# EAGLE design radiationsensor_r1 (EAGLE 6.5.0)
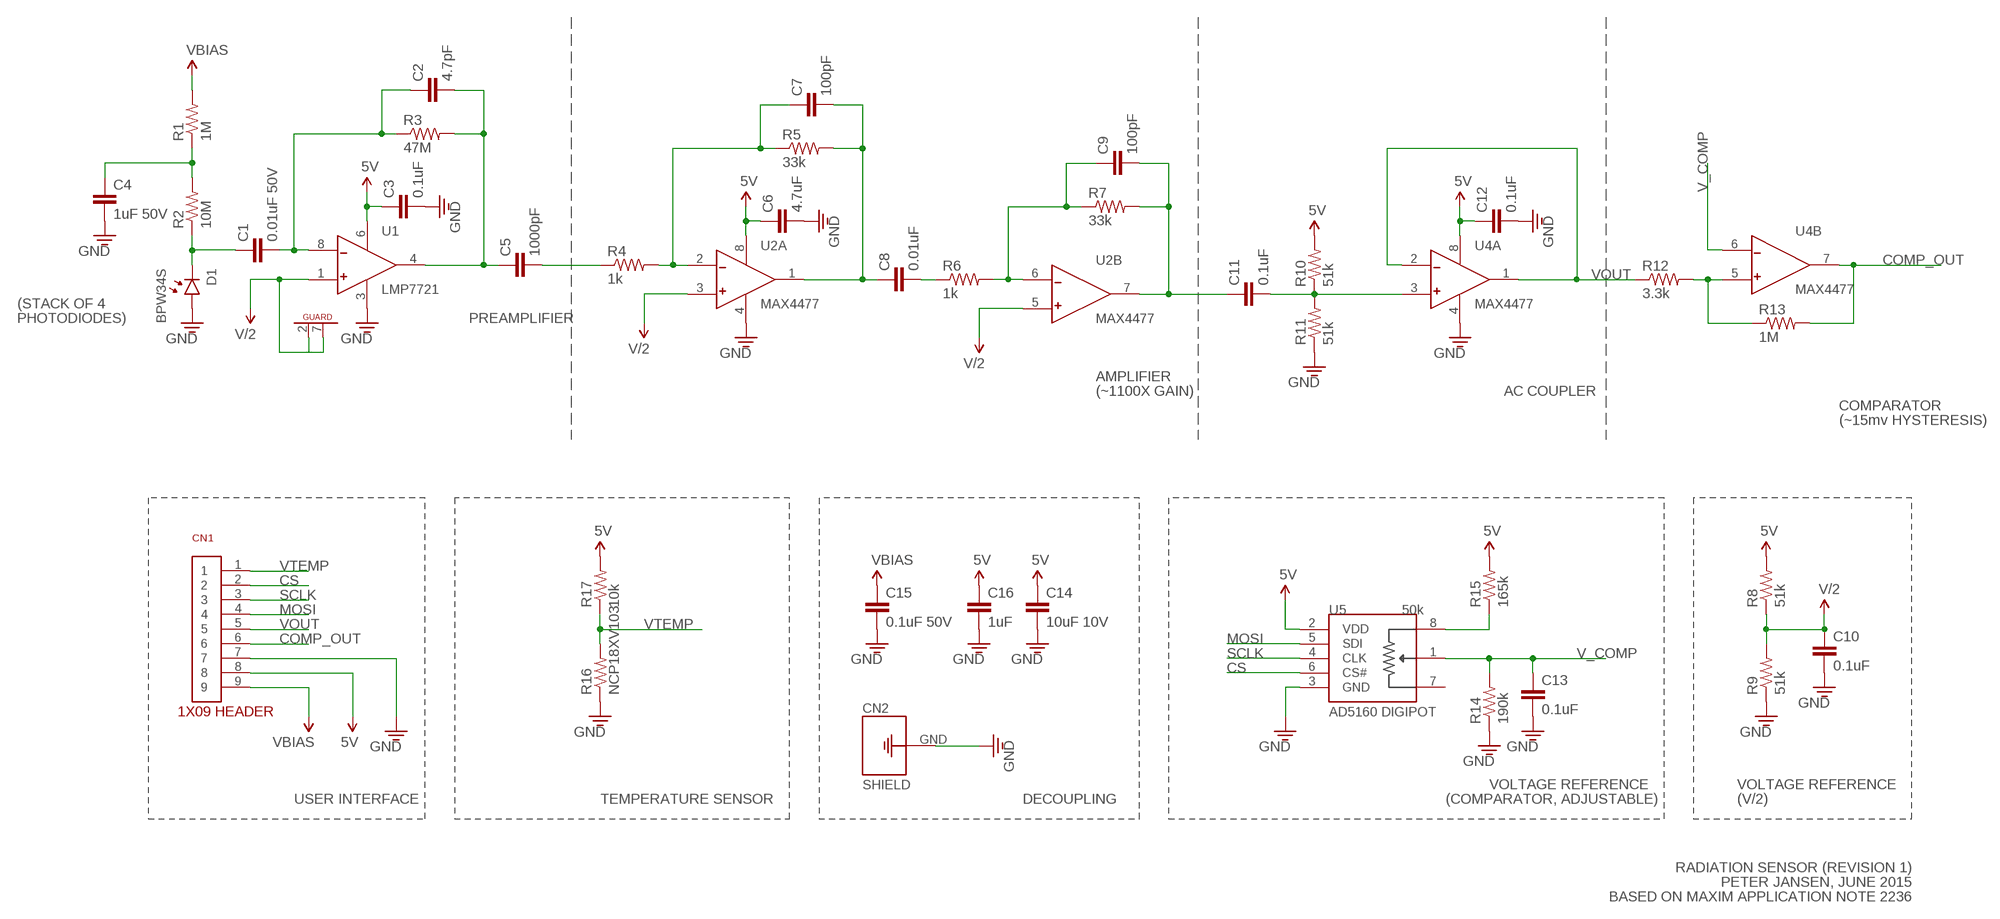
[diagram p0: schematic, sheet 1]

## Parts
C1  0.01uF 50V  CAP0603  [0603]
C2  4.7pF  CAP0603  [0603]
C3  0.1uF  CAP0603  [0603]
C4  1uF 50V  CAP0603  [0603]
C5  1000pF  CAP0603  [0603]
C6  4.7uF  CAP0603  [0603]
C7  100pF  CAP0603  [0603]
C8  0.01uF  CAP0603  [0603]
C9  100pF  CAP0603  [0603]
C10  0.1uF  CAP0603  [0603]
C11  0.1uF  CAP0603  [0603]
C12  0.1uF  CAP0603  [0603]
C13  0.1uF  CAP0603  [0603]
C14  10uF 10V  CAP0805  [0805]
C15  0.1uF 50V  CAP0603  [0603]
C16  1uF  CAP0603  [0603]
CN1  1X09  [1X09]
CN2  GROUND-PAD  [GROUND-PAD]
D1  BPW34S  PHOTODIODE4STACK-SIDEMOUNT  [BPW34S-4STACK-SIDEMOUNT]
R1  1M  RESISTOR0603  [0603]
R2  10M  RESISTOR0603  [0603]
R3  47M  RESISTOR0603  [0603]
R4  1k  RESISTOR0603  [0603]
R5  33k  RESISTOR0603  [0603]
R6  1k  RESISTOR0603  [0603]
R7  33k  RESISTOR0603  [0603]
R8  51k  RESISTOR0603  [0603]
R9  51k  RESISTOR0603  [0603]
R10  51k  RESISTOR0603  [0603]
R11  51k  RESISTOR0603  [0603]
R12  3.3k  RESISTOR0603  [0603]
R13  1M  RESISTOR0603  [0603]
R14  190k  RESISTOR0603  [0603]
R15  165k  RESISTOR0603  [0603]
R16  NCP18XV103  RESISTOR0603  [0603]
R17  10k  RESISTOR0603  [0603]
U1  LMP7721  OPAMP-LMP7721  [SOIC-8]
U2  MAX4477  OPAMP-MAX4477  [SOIC-8]
U4  MAX4477  OPAMP-MAX4477  [SOIC-8]
U5  50k  AD5160  [SOT-23-8]

## Nets
5V: C3.1 C6.1 C12.1 C14.1 C16.1 CN1.8 R8.2 R10.2 R15.2 R17.2 U1.6(VCC) U2.8(A:V+) U4.8(A:V+) U5.2(VDD)
COMP_OUT: CN1.6 R13.2 U4.7(B:OUT)
CS: CN1.2 U5.6(CS#)
GND: C3.2 C4.2 C6.2 C10.2 C12.2 C13.2 C14.2 C15.2 C16.2 CN1.7 CN2.GND D1.A(ANODE) R9.1 R11.1 R14.1 R16.1 U1.3(GND) U2.4(A:V-) U4.4(A:V-) U5.3(GND)
MOSI: CN1.4 U5.5(SDI)
N$1: C1.2 C2.1 R3.1 U1.8(-)
N$2: C1.1 D1.C(CATHODE) R2.1
N$3: C7.2 C8.1 R5.2 U2.1(A:OUT)
N$4: C4.1 R1.1 R2.2
N$5: C7.1 R4.2 R5.1 U2.2(A:-)
N$6: C5.2 R4.1
N$7: C2.2 C5.1 R3.2 U1.4(OUT)
N$8: C9.1 R6.2 R7.1 U2.6(B:-)
N$9: C8.2 R6.1
N$10: C11.2 R10.1 R11.2 U4.3(A:+)
N$11: C9.2 C11.1 R7.2 U2.7(B:OUT)
N$14: R12.2 R13.1 U4.5(B:+)
N$17: R15.1 U5.8(A)
SCLK: CN1.3 U5.4(CLK)
V/2: C10.1 R8.1 R9.2 U1.1(+) U1.2(G1) U1.7(G2) U2.3(A:+) U2.5(B:+)
V_COMP: C13.1 R14.2 U4.6(B:-) U5.1(W)
VBIAS: C15.1 CN1.9 R1.2
VOUT: CN1.5 R12.1 U4.1(A:OUT) U4.2(A:-)
VTEMP: CN1.1 R16.2 R17.1
Unconnected: U5.7(B)

## Notes on the sheet
- (STACK OF 4
- PHOTODIODES) | PREAMPLIFIER
- AMPLIFIER
- (~1100X GAIN) | AC COUPLER
- COMPARATOR
- (~15mv HYSTERESIS)
- VOLTAGE REFERENCE | VOLTAGE REFERENCE
- USER INTERFACE | TEMPERATURE SENSOR | DECOUPLING | (COMPARATOR, ADJUSTABLE) | (V/2)
- RADIATION SENSOR (REVISION 1)
- PETER JANSEN, JUNE 2015
- BASED ON MAXIM APPLICATION NOTE 2236

## Library data of the parts
C1-C16 = openct:CAP: Capacitor Standard 0603 ceramic capacitor, and 0.1" leaded capacitor.
CN1 = openct:1X09
CN2 = openct:GROUND-PAD: Ground pad for connection to shield
D1 = openct:PHOTODIODE: Photodiodes sensitive to high-energy particles
R1-R17 = openct:RESISTOR: Resistor Basic schematic elements and footprints for 0603, 1206, and PTH 1/10th watt (small) resistors.
U1 = openct:OPAMP-LMP7721: TI LMP7721 Precision Amplifier (3-Femtoamp Input Bias)
U2 U4 = openct:OPAMP-MAX4477: Maxim MAX4477 Low-noise, low-distortion dual op amp
U5 = openct:AD5160: AD5160 Digipot (256-Position, SPI-Compatible)

## Board
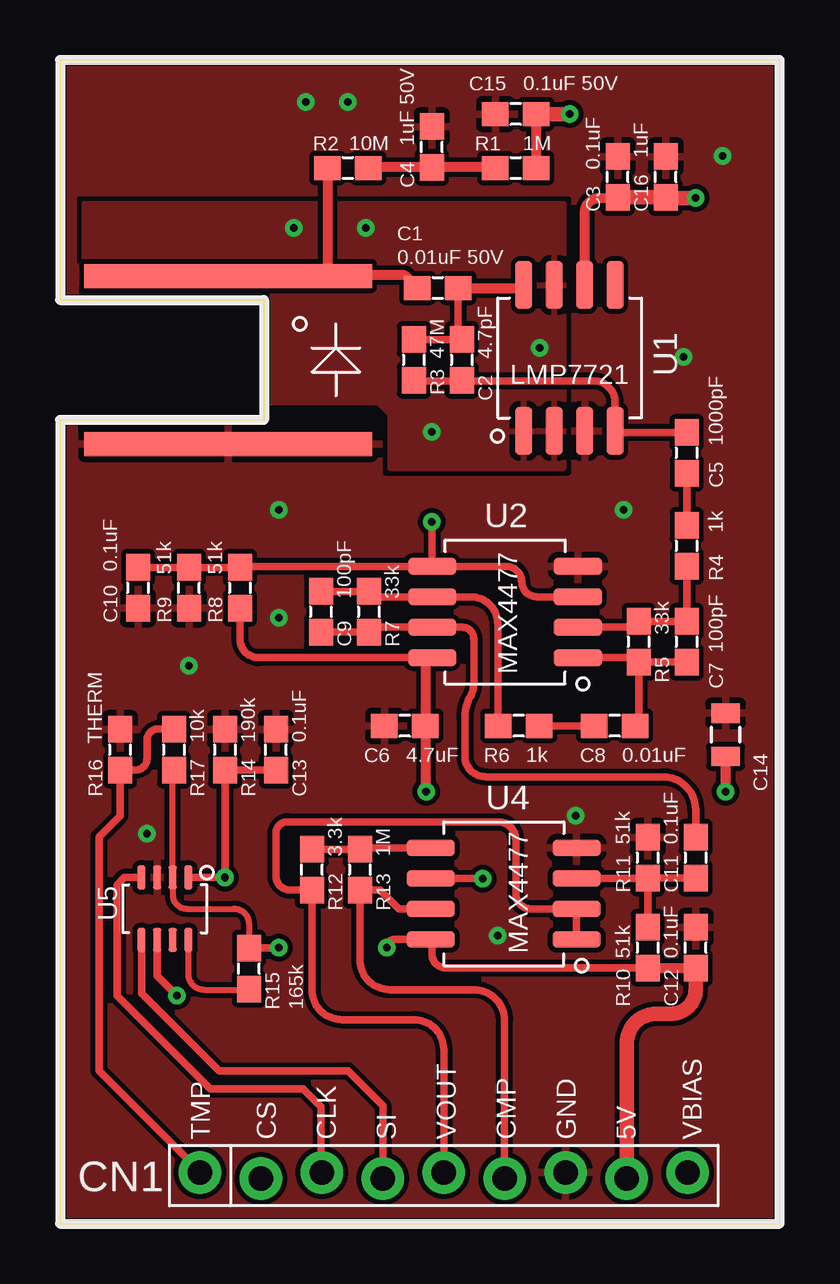
[diagram p1: board, top side]
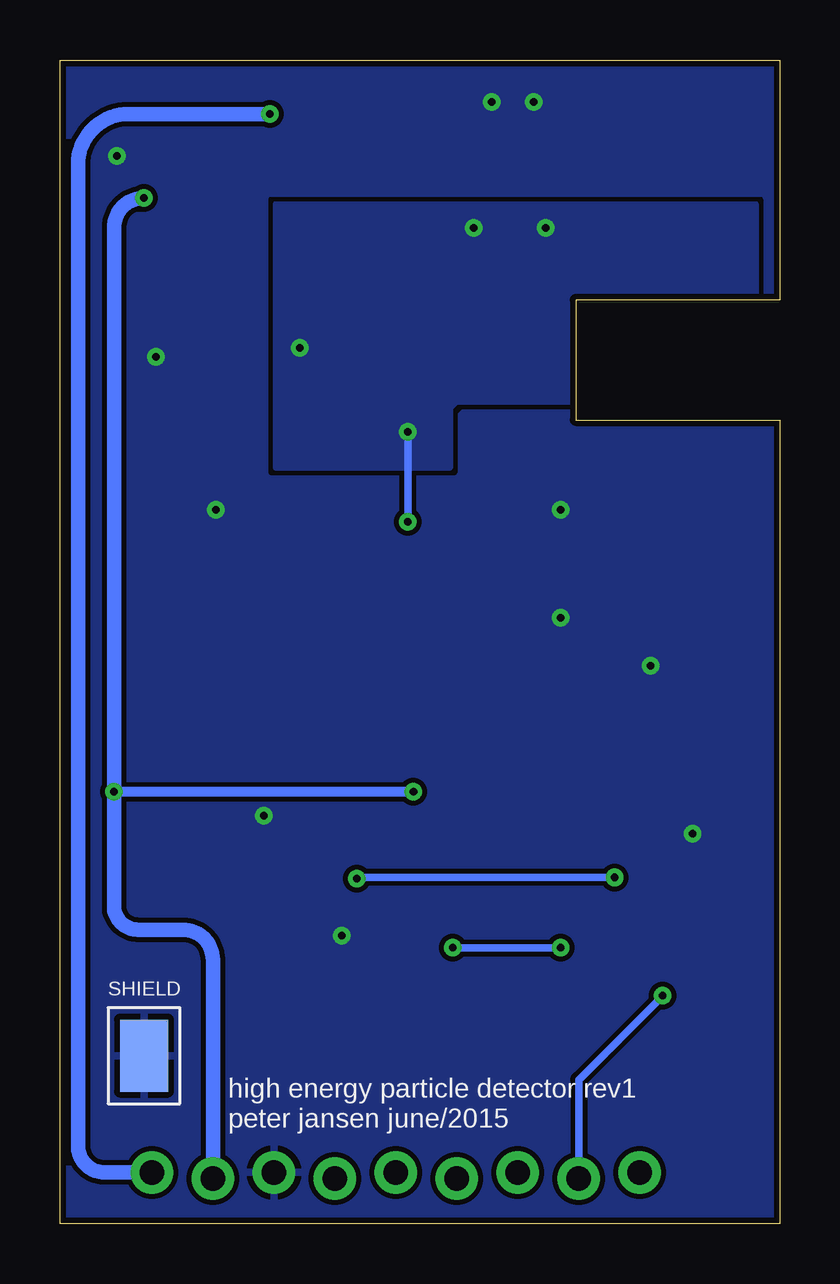
[diagram p2: board, bottom side, seen from below]

Size 30 x 48.5 mm. Coordinates in mm from the lower left corner, seen from the top.
Outline: 0,0 30,0 30,48.5 0,48.5 0,38.5 8.5,38.5 8.5,33.5 0,33.5 0,0
Copper layers (1*16): Top 0.035mm / dielectric 1.5mm / Bottom 0.035mm
Design rules "default *": minimum track width 10mil, minimum drill 13mil, track to track 8mil, track to pad 8mil, pad to pad 8mil, via to via 8mil, smd to smd 8mil, copper to edge 10mil, drill to drill 8mil, minimum pad ring 10mil, minimum via ring 8mil, stop-mask expansion 4mil, vias tented up to drill 0mil, thermal gap 10mil

### Footprints (pad centres in the part's own frame; a part is rotated, then mirrored left to right if it is on the bottom)
0603 = smd 1.1 x 1: 1 -0.85,0; 2 0.85,0
0805 = smd 0.8 x 1.2: 1 -0.9,0; 2 0.9,0
1X09 = drill 1.016 pad 1.778: 1 -10.16,0.127; 2 -7.62,-0.127; 3 -5.08,0.127; 4 -2.54,-0.127; 5 0,0.127; 6 2.54,-0.127; 7 5.08,0.127; 8 7.62,-0.127; 9 10.16,0.127
GROUND-PAD = smd 2 x 3: GND 0,0
BPW34S-4STACK-SIDEMOUNT = smd 1 x 12: A -3.5,4; C 3.5,4
SOIC-8 = smd 0.7 x 2: 1 -1.905,-3.04; 2 -0.635,-3.04; 3 0.635,-3.04; 4 1.905,-3.04; 5 1.905,3.04; 6 0.635,3.04; 7 -0.635,3.04; 8 -1.905,3.04
SOT-23-8 = smd 0.35 x 1: 1 -0.975,-1.3; 2 -0.325,-1.3; 3 0.325,-1.3; 4 0.975,-1.3; 5 0.975,1.3; 6 0.325,1.3; 7 -0.325,1.3; 8 -0.975,1.3

### Placement (x,y rotation side)
C1  15.75,39 0 top
C2  16.75,36 270 top
C3  23.25,43.62 90 top
C4  15.5,44.88 90 top
C5  26.12,32.12 270 top
C6  14.38,20.75 180 top
C7  26.12,24.25 270 top
C8  23.12,20.75 180 top
C9  10.88,25.5 270 top
C10  3.25,26.5 270 top
C11  26.5,15.25 270 top
C12  26.5,11.5 90 top
C13  9,19.75 90 top
C14  27.75,20.38 90 top
C15  19,46.25 180 top
C16  25.25,43.62 90 top
CN1  16,2 0 top
CN2  26.5,7 0 bottom
D1  11,36 90 top
R1  19,44 0 top
R2  12,44 0 top
R3  14.75,36 270 top
R4  26.12,28.25 270 top
R5  24.12,24.25 270 top
R6  19.12,20.75 180 top
R7  12.88,25.5 270 top
R8  7.5,26.5 270 top
R9  5.38,26.5 90 top
R10  24.5,11.5 270 top
R11  24.5,15.25 270 top
R12  10.5,14.75 90 top
R13  12.5,14.75 270 top
R14  6.88,19.75 270 top
R15  7.88,10.62 90 top
R16  2.5,19.75 270 top
R17  4.75,19.75 270 top
U1  21.24,36.08 0 top
U2  18.55,25.49 90 top
U4  18.5,13.75 90 top
U5  4.38,13.12 180 top

### Tracks (layer width: path | path; a pad name or v marks a point on that pad's centre or on a via)
5V  (via drill 0.33)
  Top 0.254: R17.2 arc90 4.7,18.85 U5.2 4.7,13.7 arc90 5.27,13.12 7.25,13.12 arc-90 7.88,12.5 R15.2
  Top 0.305: 15.27,20.79 arc90 C6.1 | 24.58,10.57 R10.2 16.1,10.65 arc-90 15.5,11.25 15.5,11.8 U4.8 13.97,11.84 arc90 v13.62,11.5 | 26.62,10.7 C12.1 | U2.8 8.29,23.59 arc-90 7.5,24.38 R8.2 | v9.12,11.5 7.9,11.5 arc90 R15.2 | CN1.8 arc-90 CN1.8
  Top 0.406: U1.6 21.88,42.12 arc-90 22.5,42.75 C3.1 | U2.8 15.27,23.59 15.27,20.79 arc-90 C6.1 arc-90 15.27,20.71 v15.27,18 | v27.75,18 C14.1 | 26.5,10.57 26.5,10.62 | R10.2 C12.1
  Top 0.61: 26.62,10.7 26.5,10.57 | v26.5,42.75 25.27,42.75 arc-90 C16.1 C3.1 | C12.1 26.5,9.75 arc-90 25.5,8.75 24.88,8.75 arc90 23.62,7.5 CN1.8
  Bottom 0.305: v13.62,11.5 v9.12,11.5
  Bottom 0.406: v15.27,18 v27.75,18
  Bottom 0.61: v26.5,42.75 arc-90 27.75,41.5 v27.75,18 27.75,13.25 arc-90 26.75,12.25 24.88,12.25 arc90 23.62,11 CN1.8 arc-90 CN1.8
COMP_OUT
  Top 0.305: U4.7 14.13,13.12 13.35,13.9 R13.2 12.5,11 arc90 13.75,9.75 17.25,9.75 arc-90 18.54,8.46 CN1.6
CS  (via drill 0.33)
  Top 0.305: U5.6 4.05,10.32 v4.88,9.5
  Bottom 0.305: v4.88,9.5 8.38,6 CN1.2
GND  (via drill 0.33)
  other vias: 10.25,46.75 12,46.75 27.62,44.5 3.62,16.25 18.25,12 9.12,25.25 26,36.12 23.5,29.75 9.12,29.75 5.38,23.25 21.5,17
  pour Top (rank 3): 0.25,0.25 0.25,48.5 30,48.5 30,0.25
  pour Bottom (rank 3): 0.25,0.25 0.25,48.5 30,48.5 30,0.25
MOSI
  Top 0.305: U5.5 3.4,9.6 6.62,6.38 12,6.38 13.46,4.91 CN1.4
N$1
  Top 0.305: R3.1 C2.1 arc-90 16.6,37 C1.2
  Top 0.406: C1.2 19.22,39 arc90 U1.8
N$2
  Top 0.406: R2.1 11.15,39.52 | 11.15,39.52 arc-90 11.12,39.5 D1.C | C1.1 14.38,39.52 11.15,39.52
N$3
  Top 0.305: C7.2 R5.2 | U2.1 23.94,23.59 R5.2 | R5.2 24.12,20.9 C8.1
N$4
  Top 0.406: R1.1 18.15,44.02 C4.1 12.88,44.02 arc90 R2.2
N$5
  Top 0.305: R5.1 C7.1 R4.2 | U2.2 23.88,24.85 R5.1 | 24.1,25.12 R5.1
N$6
  Top 0.305: C5.2 R4.1
N$7
  Top 0.305: 16.75,35.12 22.25,35.12 arc-90 23.15,34.23 U1.4 23.21,32.98 C5.1 | 16.75,35.12 14.77,35.12 arc-90 R3.2 | C2.2 16.75,35.12
N$8
  Top 0.305: C9.1 R7.1 13.1,26.12 U2.6 17.12,26.12 arc-90 18.25,25 18.25,20.77 arc90 R6.2
N$9
  Top 0.305: C8.2 R6.1
N$10
  Top 0.305: R10.1 R11.2 | U4.3 24.48,14.38 R11.2 | R11.2 C11.2
N$11
  Top 0.305: C9.2 R7.2 13.08,24.85 U2.7 16.77,24.85 arc-90 17.25,24.38 17.25,22.5 arc-28 17.12,22 arc31 16.88,21.12 16.88,19.5 arc90 17.75,18.62 25.12,18.62 arc-90 26.5,17.25 C11.1
N$14
  Top 0.305: U4.5 12.55,15.66 R13.1 R12.2
N$17
  Top 0.254: U5.8 5.35,10.4 arc90 6,9.75 7.85,9.75 arc90 R15.1
SCLK
  Top 0.305: U5.4 2.67,14.42 2.38,14.12 2.38,9.5 6.25,5.62 10.12,5.62 10.88,4.88 10.88,2.17 CN1.3
V/2  (via drill 0.33)
  Top 0.305: U2.3 19.88,26.12 arc-90 19.25,26.75 arc90 18.6,27.4 U2.5 | U2.5 7.55,27.4 R8.1 R9.2 C10.1 | v15.5,29.25 15.5,27.41 U2.5
  Bottom 0.305: v15.5,29.25 v15.5,33
  other vias: 20,36.5 12.75,41.5 9.75,41.5
  pour Top: 21,31.5 21,42.5 1,42.5 1,34.25 13.25,34.25 13.75,33.75 13.75,31.5
  pour Bottom: 21,31.5 21,42.5 1,42.5 1,34.25 13.5,34.25 13.75,34 13.75,31.5
V_COMP  (via drill 0.33)
  Top 0.305: U4.6 v17.62,14.38 arc-90 v17.62,14.38 | C13.1 R14.2 v6.88,14.42 U5.1
  Bottom 0.305: v6.88,14.42 17.58,14.42 arc-90 v17.62,14.38
VBIAS  (via drill 0.33)
  Top 0.406: C15.1 R1.2
  Top 0.61: v21.25,46.25 C15.1
  Bottom 0.61: CN1.9 28.13,2.13 arc90 29.25,3.25 29.25,44.12 arc90 27.12,46.25 v21.25,46.25
VOUT
  Top 0.305: U4.1 U4.2 19.63,13.12 arc-90 19,13.75 19,16 arc90 18.25,16.75 9.5,16.75 arc90 9,16.25 9,14.5 arc90 9.6,13.9 R12.1 10.5,9.75 arc90 11.75,8.5 14.75,8.5 arc-90 16,7.25 CN1.5
VTEMP
  Top 0.305: R17.1 arc5 4.12,20.62 arc90 3.62,20.12 3.62,19.38 arc-90 3.15,18.9 R16.2 2.5,17 1.62,16.12 1.62,6.38 5.84,2.16 CN1.1

### Text on the board
tPlace: LMP7721 | MAX4477 | THERM | MAX4477 | TMP | CS | CLK | SI | VOUT | CMP | GND | 5V | VBIAS
bPlace: SHIELD | high energy particle detector rev1 | peter jansen june/2015